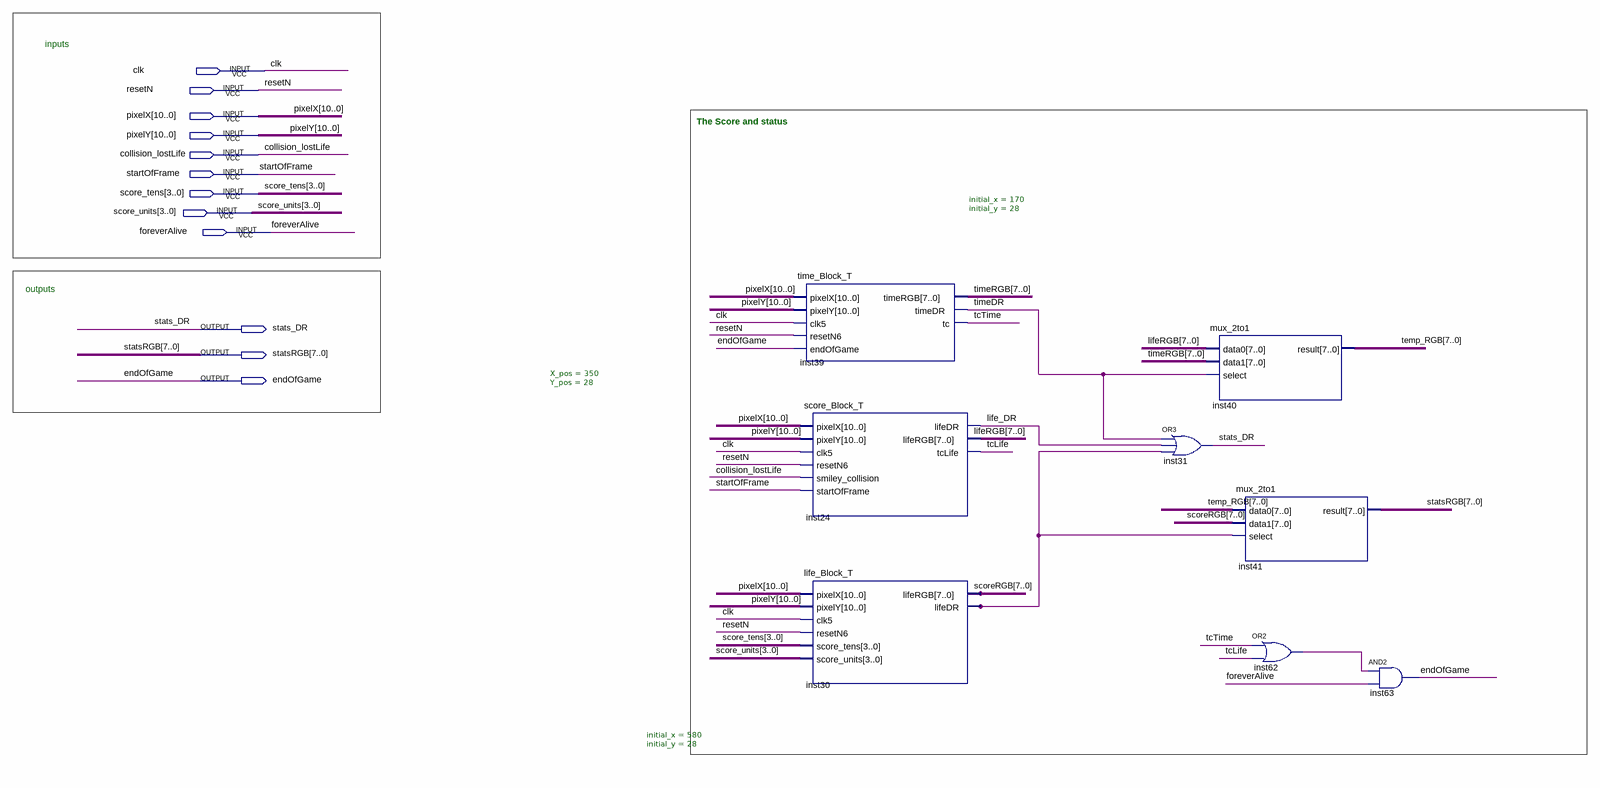
[diagram p0: schematic sheet]
// Quartus schematic status_top.bdf as structural Verilog: 8 symbols, 12 pins
module status_top (
  input  clk,
  input  resetN,
  input  [10:0] pixelX,
  input  [10:0] pixelY,
  input  collision_lostLife,
  input  startOfFrame,
  input  [3:0] score_tens,
  input  [3:0] score_units,
  input  foreverAlive,
  output stats_DR,
  output [7:0] statsRGB,
  output endOfGame
);

  wire inst30_lifedr, inst62_out, life_DR, tcLife, tcTime, timeDR;
  wire [7:0] lifeRGB, scoreRGB, temp_RGB, timeRGB;

  time_Block_T #(.initial_x(170), .initial_y(28)) inst39 (
    .pixelX(pixelX), .pixelY(pixelY), .clk5(clk), .resetN6(resetN), .endOfGame(endOfGame), .timeRGB(timeRGB),
    .timeDR(timeDR), .tc(tcTime));
  score_Block_T #(.X_pos(350), .Y_pos(28)) inst24 (
    .pixelX(pixelX), .pixelY(pixelY), .clk5(clk), .resetN6(resetN), .smiley_collision(collision_lostLife),
    .startOfFrame(startOfFrame), .lifeDR(life_DR), .lifeRGB(lifeRGB), .tcLife(tcLife));
  life_Block_T #(.initial_x(580), .initial_y(28)) inst30 (
    .pixelX(pixelX), .pixelY(pixelY), .clk5(clk), .resetN6(resetN), .score_tens(score_tens),
    .score_units(score_units), .lifeRGB(scoreRGB), .lifeDR(inst30_lifedr));
  or inst31 (stats_DR, timeDR, life_DR, inst30_lifedr);
  mux_2to1 inst40 (.data0(lifeRGB), .data1(timeRGB), .select(timeDR), .result(temp_RGB));
  mux_2to1 inst41 (.data0(temp_RGB), .data1(scoreRGB), .select(inst30_lifedr), .result(statsRGB));
  or inst62 (inst62_out, tcTime, tcLife);
  and inst63 (endOfGame, inst62_out, foreverAlive);

  // Notes on the sheet:
  //   inputs
  //   The Score and status
  //   outputs
endmodule
